# Altium project TIDA-010933-RevA.PrjPcb (part 4 of 8)

## Sheet TIDA-010933-DCDC-Power.SchDoc
size 431 x 279 mm; Date: Not shown in title block; ApprovedBy: Not shown in title block; CheckedBy: Not shown in title block; Author: Not shown in title block; CompanyName: Not shown in title block; Engineer: Not shown in title block; Organization: Not shown in title block; Address1: Not shown in title block; Address2: Not shown in title block; Address3: Not shown in title block; Address4: Not shown in title block; DocumentNumber: 2; Revision: Use project parameter SCH_Rev; SheetNumber: 6; SheetTotal: 11; PageSetup: Record=PageOptions|CenterHorizontal=True|CenterVertical=True|PrintScale=1.00|XCorrection=1.00|YCorrection=1.00|PrintKind=0|BorderSize=5000000|LeftOffset=0|BottomOffset=0|Orientation=2|PaperLength=1000|PaperWidth=1000|Scale=100|PaperSource=15|PrintQuality=600|MediaType=1|DitherType=10|PaperKind=Letter|PrintScaleMode=1; CurrentTime: Not shown in title block; CurrentDate: Not shown in title block; Time: Not shown in title block; DocumentFullPathAndName: Not shown in title block; DocumentName: Not shown in title block; ModifiedDate: 1/25/2022; ImagePath: Not shown in title block
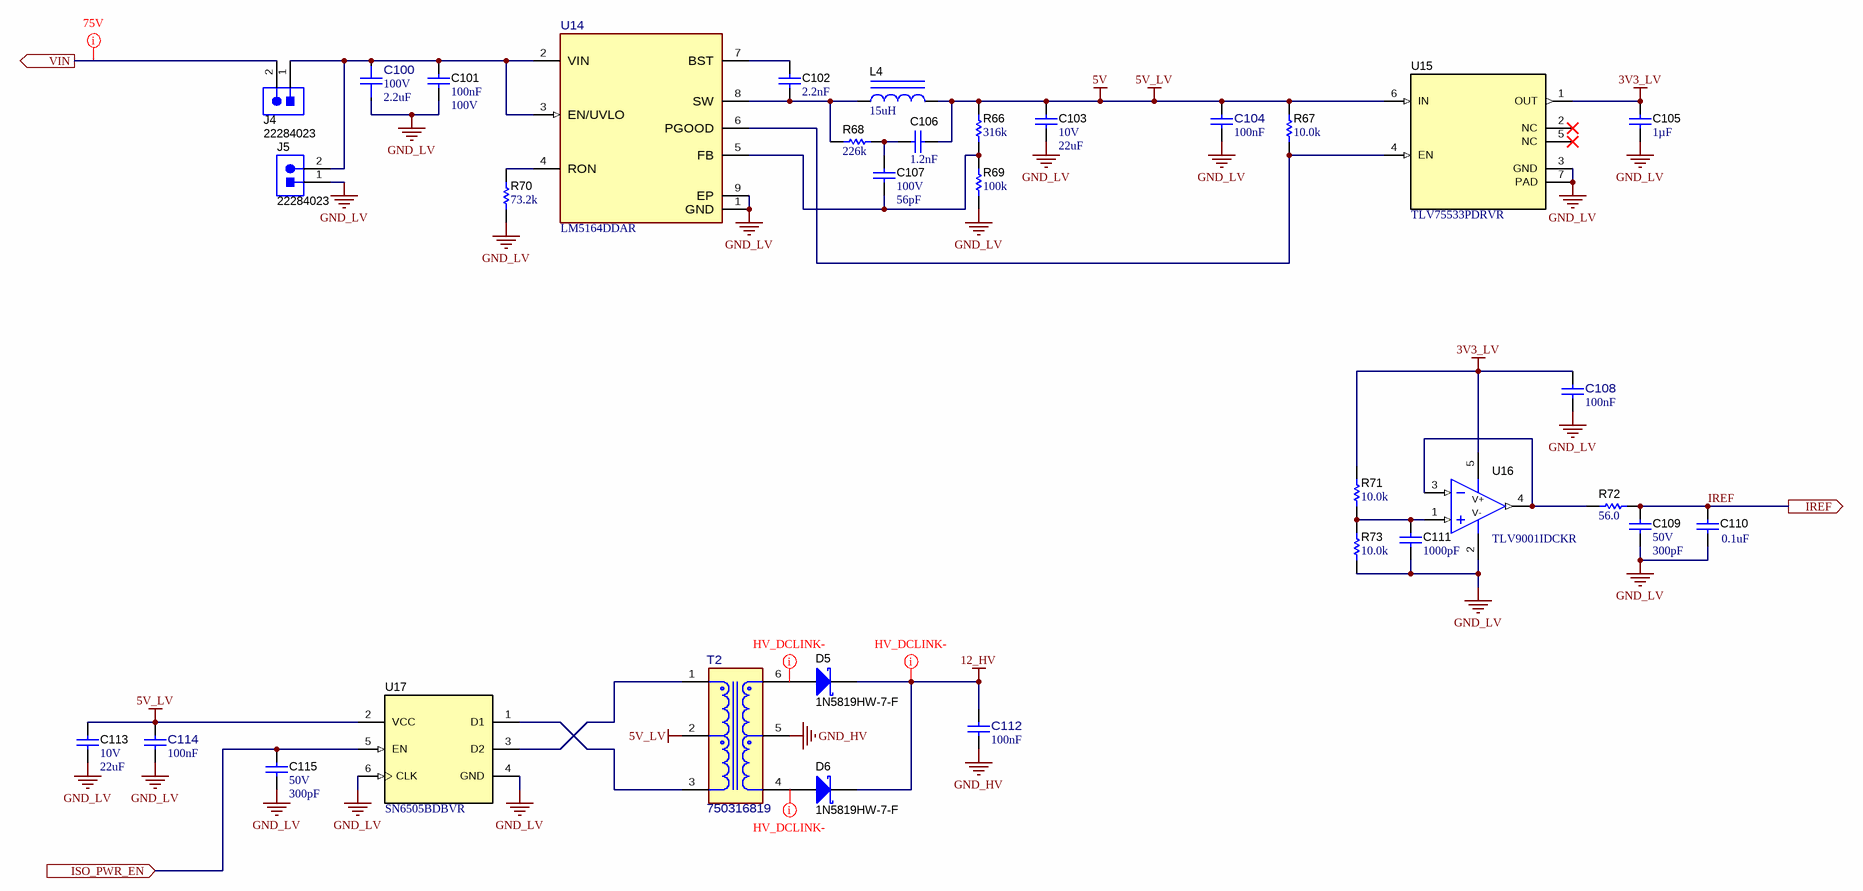
[diagram p5: TIDA-010933-DCDC-Power.SchDoc]

### Parts
C100  VDC_V: 100V  ValueDisplayed: 2.2uF  [FP-C3225X7R2A225K230AB_1210-MFG]  (hidden comment: C3225X7R2A225K230AB)
C101  Cap_F: 100nF  VDC_V: 100V  [0603]  (hidden comment: GRM188R72A104KA35D)
C102  Cap_F: 2.2nF  [0603]  (hidden comment: C0603C222K5RAC)
C103  VDC_V: 10V  ValueDisplayed: 22uF  [1206_180]  (hidden comment: GRM31CR71A226KE15L)
C104  Cap_F: 100nF  [FP-CL10B104KB8NNNC_0603-IPC_B]  (hidden comment: CL10B104KB8NNNC)
C105  Cap_F: 1µF  [0603]  (hidden comment: 885012206026)
C106  Cap_F: 1.2nF  [0603]  (hidden comment: GRM188R72A122KA01D)
C107  VDC_V: 100V  ValueDisplayed: 56pF  [0603]  (hidden comment: GRM1885C2A560JA01D)
C108  Cap_F: 100nF  [FP-CL10B104KB8NNNC_0603-IPC_B]  (hidden comment: CL10B104KB8NNNC)
C109  VDC_V: 50V  ValueDisplayed: 300pF  [0603]  (hidden comment: GRM1885C1H301JA01D)
C110  ValueDisplayed: 0.1uF  [0402]  (hidden comment: GRM155R71E104KE14D)
C111  ValueDisplayed: 1000pF  [0603]  (hidden comment: CC0603JRNPO8BN102)
C112  Cap_F: 100nF  [FP-CL10B104KB8NNNC_0603-IPC_B]  (hidden comment: CL10B104KB8NNNC)
C113  VDC_V: 10V  ValueDisplayed: 22uF  [1206_180]  (hidden comment: GRM31CR71A226KE15L)
C114  Cap_F: 100nF  [FP-CL10B104KB8NNNC_0603-IPC_B]  (hidden comment: CL10B104KB8NNNC)
C115  VDC_V: 50V  ValueDisplayed: 300pF  [0603]  (hidden comment: GRM1885C1H301JA01D)
D5  1N5819HW-7-F  [SOD-123]
D6  1N5819HW-7-F  [SOD-123]
J4  22284023  [Molex_0022284023]
J5  22284023  [Molex_0022284023]
L4  ValueDisplayed: 15uH  [SRP6540]  (hidden comment: SRP6540-150M)
R66  ValueDisplayed: 316k  [0603]  (hidden comment: RC0603FR-07316KL)
R67  ValueDisplayed: 10.0k  [0402]  (hidden comment: RC0402FR-0710KL)
R68  ValueDisplayed: 226k  [0603]  (hidden comment: RC0603FR-07226KL)
R69  ValueDisplayed: 100k  [0603]  (hidden comment: RC0603FR-07100KL)
R70  ValueDisplayed: 73.2k  [0603]  (hidden comment: RC0603FR-0773K2L)
R71  ValueDisplayed: 10.0k  [0603]  (hidden comment: RT0603BRD0710KL)
R72  ValueDisplayed: 56.0  [0603]  (hidden comment: RC0603FR-0756RL)
R73  ValueDisplayed: 10.0k  [0603]  (hidden comment: RT0603BRD0710KL)
T2  750316819  [FP-750316819_SMT_XFRMR_9MM25_8MM30-MFG]
U14  LM5164DDAR  [DDA0008E-MFG]
U15  TLV75533PDRVR  [DRV0006A]
U16  TLV9001IDCKR  [DCK0005A_N]
U17  SN6505BDBVR  [DBV0006A_L]

### Ports
IREF (out), ISO_PWR_EN (in), VIN (out)

### Nets
3V3_LV: C105.1 C108.1 R71.1 U15.1(OUT) U16.5(V+)  [project net 3V3]
5V: C103.1 C104.2 C106.1 C113.1 C114.1 L4.2 R66.2 R67.2 T2.2 U15.6(IN) U17.2(VCC)  [also labelled 5V_LV]
12_HV: C112.1 D5.1(K) D6.1(K)
GND_HV: C112.2 T2.5
GND_LV: C100.1 C101.2 C103.2 C104.1 C105.2 C108.2 C109.2 C110.2 C111.2 C113.2 C114.2 C115.2 J5.1 R69.1 R70.1 R73.2 U14.1(GND) U14.9(EP) U15.3(GND) U15.7(PAD) U16.2(V-) U17.4(GND) U17.6(CLK)  [project net GND]
75V: J4.2 ; port VIN
IREF: C109.1 C110.1 R72.2 ; port IREF
ISO_PWR_EN: C115.1 U17.5(EN) ; port ISO_PWR_EN
NetC100_2: C100.2 C101.1 J4.1 J5.2 U14.2(VIN) U14.3(EN/UVLO)
NetC102_1: C102.1 U14.7(BST)
NetC102_2: C102.2 L4.1 R68.1 U14.8(SW)
NetC106_2: C106.2 C107.1 R68.2
NetC107_2: C107.2 R66.1 R69.2 U14.5(FB)
NetC111_1: C111.1 R71.2 R73.1 U16.1(IN+)
NetD5_2: D5.2(A) T2.6
NetD6_2: D6.2(A) T2.4
NetR67_1: R67.1 U14.6(PGOOD) U15.4(EN)
NetR70_2: R70.2 U14.4(RON)
NetR72_1: R72.1 U16.3(IN-) U16.4(OUT)
NetT2_1: T2.1 U17.3(D2)
NetT2_3: T2.3 U17.1(D1)

Not connected (* = marked no-connect by the designer): U15 2(NC)* 5(NC)*

### Layout directives
net class 75V: 75V
net class HV_DCLINK-: 12_HV, NetD5_2, NetD6_2

### Notes on the sheet
- Drawn By:
- SVN Rev:
- Number:
- TID #:
- Orderable:
- Rev:
- Sheet Title:
- File:
- Project Title:
- Designed for:
- Assembly Variant:
- Mod. Date:
- Sheet:
- Size:
- of
- B
- http://www.ti.com
- Texas Instruments and/or its licensors do not warrant the accuracy or completeness of this specification or any information contained therein. Texas Instruments and/or its licensors do not warrant that this design will meet the specifications, will be suitable for your application or fit for any particular purpose, or will operate in an implementation. Texas Instruments and/or its licensors do not warrant that the design is production worthy. You should completely validate and test your design implementation to confirm the system functionality for your application.
- Engineer:
- Contact:
- © Texas Instruments

### Library data of the parts
C100 = CMP-0095533-2: CAP, CERM, 2.2 uF, 100 V, +/- 10%, X7R, 1210; Manufacturer: TDK; AEC Qualified: No; Value: 2.2µF; Tolerance_%: 0.1%; TempCo: 0.15; SizeZ_mm: 2.5mm; RoHS: TRUE; ComponentLink1URL: https://product.tdk.com/en/search/capacitor/ceramic/mlcc/info?part_no=C3225X7R2A225K230AB; Part Number: C3225X7R2A225K230AB; ComponentLink1Description: Datasheet; PartNumber: C3225X7R2A225K230AB; Datasheet Path: datasheets/Cap-C3225X7R2A225K230AB.pdf; Operating Temperature Range: -55°C  to +125°C; PackageReference: 1210; Lead Free: Yes; datasheet: https://product.tdk.com/en/search/capacitor/ceramic/mlcc/info?part_no=C3225X7R2A225K230AB; Temperature Characteristic: X7R; Cap_F: 2.2µF; helpURL: https://upverter.com/upn/revision/88efa44f12133509/
C101 = CMP-0007469-4: CAP, CERM, 0.1 uF, 100 V, +/- 10%, X7R, 0603; Manufacturer: MuRata; TaMin_C: -55°C; Polarized: N; SizeAreaWB_mm2: 4.68; Value1: Unknown; U/M: EA; Value: 0.1uF; TaMax_C: 125°C; SizeZ_mm: 1; SizeX_mm: 1.6; SizeY_mm: 0.8; SizeArea_mm2: 1.28; AEC Category: Q200; Supplier Part Number 2: 81-GRM188R72A104KA35; Publisher: Texas Instruments; Supplier 2: Mouser; Supplier Part Number 3: 1828921; TempCo: X7R; Supplier 3: Farnell; Published: 2008-06-19; RoHS: Y; MountType: SMT; Supplier 1: Digi-Key; PackageReference: 0603; Tolerance_%: 10%; Cap_Case: 0603; Value2: 100V; CompType: Capacitor; LatestRevisionDate: 2017-03-09; PartNumber: GRM188R72A104KA35D; AEC Qualified: ?; ComponentLink1Description: Datasheet link; Supplier Part Number 1: 490-3285-1-ND; Technology: Ceramic; ValueDisplayed: 0.1uF; ComponentLink1URL: http://search.murata.co.jp/Ceramy/PnsearchViewAction.do?HnOFG=ON&HnNFG=ON&SEL_CNT=50&sLang=en&sKey=GRM188R72A104KA35D&x=9&y=9&search=startwith
C102 = CMP-0006897-4: CAP, CERM, 2200 pF, 50 V, +/- 10%, X7R, 0603; Manufacturer: Kemet; TaMin_C: -55°C; Polarized: N; SizeAreaWB_mm2: 4.68; Value1: Unknown; U/M: EA; Value: 2200pF; TaMax_C: 125°C; SizeZ_mm: 1; SizeX_mm: 1.6; SizeY_mm: 0.8; Value2: 50V; SizeArea_mm2: 1.28; AEC Category: Q200; Publisher: Texas Instruments; TempCo: X7R; Published: 2008-06-19; RoHS: Y; MountType: SMT; Supplier 1: Farnell; PackageReference: 0603; Tolerance_%: 10%; Cap_Case: 0603; CompType: Capacitor; LatestRevisionDate: 2017-03-09; PartNumber: C0603C222K5RAC; AEC Qualified: ?; VDC_V: 50V; ComponentLink1Description: Datasheet link; Supplier Part Number 1: 1362428; Technology: Ceramic; ValueDisplayed: 2200pF; ComponentLink1URL: http://www.kemet.com/kemet/web/homepage/kechome.nsf/vapubfiles/F3102_Y5V.pdf/$file/F3102_Y5V.pdf
C103 C113 = CMP-0008959-2: CAP, CERM, 22 uF, 10 V, +/- 10%, X7R, 1206; Manufacturer: MuRata; TaMin_C: -55°C; Polarized: N; SizeAreaWB_mm2: 10.92; Value1: Unknown; U/M: EA; Value: 22uF; TaMax_C: 125°C; SizeZ_mm: 1.8; SizeX_mm: 3.2; SizeY_mm: 1.6; Cap_Case: 1206; SizeArea_mm2: 5.12; Cap_F: 22µF; AEC Category: Q200; Supplier Part Number 2: 81-GRM31CR71A226K15L; Publisher: Texas Instruments; Supplier 2: Mouser; Supplier Part Number 3: 1797016; TempCo: X7R; Supplier 3: Farnell; Published: 2008-06-19; RoHS: Y; MountType: SMT; Supplier 1: Digi-Key; PackageReference: 1206; Tolerance_%: 10%; Value2: 10V; CompType: Capacitor; LatestRevisionDate: 2017-03-09; PartNumber: GRM31CR71A226KE15L; AEC Qualified: ?; ComponentLink1Description: Datasheet link; Supplier Part Number 1: 490-5309-1-ND; Technology: Ceramic; ComponentLink1URL: http://search.murata.co.jp/Ceramy/PnsearchViewAction.do?HnOFG=ON&HnNFG=ON&SEL_CNT=50&sLang=en&sKey=GRM31CR71A226KE15L&x=9&y=9&search=startwith
C104 C108 C112 C114 = CMP-0087079-2: as C82 on sheet TIDA-010933-DCDC-HVGAN; ComponentLink1Description: Datasheet; PackageReference: 0603; RoHS: TRUE; ComponentLink1URL: http://www.samsungsem.com/kr/support/product-search/mlcc/__icsFiles/afieldfile/2018/07/24/CL10B104KB8NNNC.pdf; VDC_V: 50V; PartNumber: CL10B104KB8NNNC
C105 = CMP-0064932-4: CAP, CERM, 1 uF, 10 V,+/- 10%, X7R, 0603; Manufacturer: Wurth Elektronik; TaMin_C: -55°C; Polarized: N; SizeAreaWB_mm2: 4.68; Value1: Unknown; U/M: EA; Value: 1uF; TaMax_C: 125°C; SizeZ_mm: 1; SizeX_mm: 1.6; SizeY_mm: 0.8; Value2: 10V; SizeArea_mm2: 1.28; AEC Category: Q200; Supplier Part Number 2: 15AC9362; Publisher: Texas Instruments; Supplier 2: Newark; Supplier Part Number 3: 710-885012206026; TempCo: X7R; Supplier 3: Mouser; Published: 2008-06-19; RoHS: Y; MountType: SMT; Supplier 1: Digi-Key; PackageReference: 0603; Tolerance_%: 10%; Cap_Case: 0603; CompType: Capacitor; LatestRevisionDate: 2017-06-05; PartNumber: 885012206026; AEC Qualified: N; VDC_V: 10V; ComponentLink1Description: Datasheet link; AEC Grade: N/A; Supplier Part Number 1: 732-7945-1-ND; Technology: Ceramic; ValueDisplayed: 1uF; ComponentLink1URL: http://katalog.we-online.com/pbs/datasheet/885012206026.pdf
C106 = CMP-0007471-5: CAP, CERM, 1200 pF, 100 V, +/- 10%, X7R, 0603; Manufacturer: MuRata; TaMin_C: -55°C; Polarized: N; SizeAreaWB_mm2: 4.68; Value1: Unknown; U/M: EA; Value: 1200pF; TaMax_C: 125°C; SizeZ_mm: 1; SizeX_mm: 1.6; SizeY_mm: 0.8; Value2: 100V; SizeArea_mm2: 1.28; AEC Category: Q200; Supplier Part Number 2: 81-GRM18R72A122KA01D; Publisher: Texas Instruments; Supplier 2: Mouser; TempCo: X7R; Published: 2008-06-19; RoHS: Y; MountType: SMT; Supplier 1: Digi-Key; PackageReference: 0603; Tolerance_%: 10%; Cap_Case: 0603; CompType: Capacitor; LatestRevisionDate: 2017-03-09; PartNumber: GRM188R72A122KA01D; AEC Qualified: ?; VDC_V: 100V; ComponentLink1Description: Datasheet link; Supplier Part Number 1: 490-1474-1-ND; Technology: Ceramic; ValueDisplayed: 1200pF; ComponentLink1URL: http://search.murata.co.jp/Ceramy/PnsearchViewAction.do?HnOFG=ON&HnNFG=ON&SEL_CNT=50&sLang=en&sKey=GRM188R72A122KA01D&x=9&y=9&search=startwith
C107 = CMP-0007275-4: CAP, CERM, 56 pF, 100 V, +/- 5%, C0G/NP0, 0603; Manufacturer: MuRata; TaMin_C: -55°C; Polarized: N; SizeAreaWB_mm2: 4.68; Value1: Unknown; U/M: EA; Value: 56pF; TaMax_C: 125°C; SizeZ_mm: 1; SizeX_mm: 1.6; SizeY_mm: 0.8; SizeArea_mm2: 1.28; AEC Category: Q200; Supplier Part Number 2: 81-GRM185C2A560JA01D; Publisher: Texas Instruments; Supplier 2: Mouser; TempCo: C0G/NP0; Published: 2008-06-19; RoHS: Y; MountType: SMT; Supplier 1: Digi-Key; PackageReference: 0603; Tolerance_%: 5%; Cap_Case: 0603; Value2: 100V; CompType: Capacitor; LatestRevisionDate: 2017-03-09; PartNumber: GRM1885C2A560JA01D; Cap_F: 56pF; ComponentLink1Description: Datasheet link; Supplier Part Number 1: 490-1345-1-ND; Technology: Ceramic; AEC Qualified: ?; ComponentLink1URL: http://search.murata.co.jp/Ceramy/PnsearchViewAction.do?HnOFG=ON&HnNFG=ON&SEL_CNT=50&sLang=en&sKey=GRM1885C2A560JA01D&x=9&y=9&search=startwith
C109 C115 = CMP-0007206-4: CAP, CERM, 300 pF, 50 V, +/- 5%, C0G/NP0, 0603; Manufacturer: MuRata; TaMin_C: -55°C; Polarized: N; SizeAreaWB_mm2: 4.68; Value1: Unknown; U/M: EA; Value: 300pF; TaMax_C: 125°C; SizeZ_mm: 1; SizeX_mm: 1.6; SizeY_mm: 0.8; SizeArea_mm2: 1.28; AEC Category: Q200; Supplier Part Number 2: 81-GRM185C1H301JA01D; Publisher: Texas Instruments; Supplier 2: Mouser; TempCo: C0G/NP0; Published: 2008-06-19; RoHS: Y; MountType: SMT; Supplier 1: Digi-Key; PackageReference: 0603; Tolerance_%: 5%; Cap_Case: 0603; Value2: 50V; CompType: Capacitor; LatestRevisionDate: 2017-03-09; PartNumber: GRM1885C1H301JA01D; AEC Qualified: ?; Cap_F: 300pF; ComponentLink1Description: Datasheet link; Supplier Part Number 1: 490-1438-1-ND; Technology: Ceramic; ComponentLink1URL: http://search.murata.co.jp/Ceramy/PnsearchViewAction.do?HnOFG=ON&HnNFG=ON&SEL_CNT=50&sLang=en&sKey=GRM1885C1H301JA01D&x=9&y=9&search=startwith
C110 = CMP-0006659-2: CAP, CERM, 0.1 uF, 25 V, +/- 10%, X7R, 0402; Manufacturer: MuRata; TaMin_C: -55°C; Polarized: N; SizeAreaWB_mm2: 3; Value1: Unknown; U/M: EA; Value: 0.1uF; TaMax_C: 125°C; SizeZ_mm: 0.6; SizeX_mm: 1; SizeY_mm: 0.5; Value2: 25V; Cap_F: 100nF; AEC Category: Q200; Supplier Part Number 2: 31Y1751; Publisher: Texas Instruments; Supplier 2: Newark; Supplier Part Number 3: 81-GRM155R71E104KE4D; TempCo: X7R; Supplier 3: Mouser; Published: 2008-06-19; RoHS: Y; MountType: SMT; Supplier 1: Digi-Key; PackageReference: 0402; Tolerance_%: 10%; Cap_Case: 0402; SizeArea_mm2: 0.5; CompType: Capacitor; LatestRevisionDate: 2017-03-09; PartNumber: GRM155R71E104KE14D; AEC Qualified: N; VDC_V: 25V; ComponentLink1Description: Datasheet link; AEC Grade: N/A; Supplier Part Number 1: 490-10698-1-ND; Technology: Ceramic; ComponentLink1URL: http://search.murata.co.jp/Ceramy/image/img/A01X/G101/ENG/GRM155R71E104KE14-01.pdf
C111 = CMP-0860530-1: CAP, CERM, 1000 pF, 25 V,+/- 5%, C0G/NP0, 0603; Manufacturer: Yageo; SizeX_mm: 1.6; SizeArea_mm2: 1.28; Value: 1000pF; AEC Category: Q200; Cap_F: 1nF; Value2: 25V; Polarized: N; U/M: EA; SizeY_mm: 0.8; SizeZ_mm: 1; TaMax_C: 125°C; TaMin_C: -55°C; SizeAreaWB_mm2: 4.68; AEC Grade: N/A; MountType: SMT; ComponentLink1URL: http://www.yageo.com/documents/recent/UPY-GP_NP0_16V-to-50V_16.pdf; ComponentLink1Description: Datasheet link; PartNumber: CC0603JRNPO8BN102; Cap_Case: 0603; AEC Qualified: N; Technology: Ceramic; CompType: Capacitor; RoHS: Y; PackageReference: 0603; VDC_V: 25V; Tolerance_%: 5%; TempCo: C0G/NP0
D5 D6 = CMP-0028360-2: Diode, Schottky, 40 V, 1 A, SOD-123; Manufacturer: Diodes Inc.; Green_Lifecycle: Active; AEC Category: Q101; TJmax_C: 125°C; SizeArea_mm2: 6.545; Vr_V: 40V; Value1: 1A; SizeZ_mm: 1.35; Value: 40V; Vf_V: 450mV; SizeX_mm: 3.85; Green_REACh: Passed; Value2: 0.45V; SizeY_mm: 1.7; SizeAreaWB_mm2: 13.095; Green_EU RoHS: Passed; AEC Qualified: ?; ComponentLink1Description: Datasheet link; Type: Schottky; RoHS: Y; MountType: SMT; PackageReference: SOD-123; CompType: Diode; Io_A: 1A; PartNumber: 1N5819HW-7-F; ComponentLink1URL: http://www.diodes.com/datasheets/ds30217.pdf; Green_EU RoHS-2: Passed
J4 J5 = CMP-0055333-1: Header, 2.54mm, 2x1, Tin, TH; Manufacturer: Molex; CNHeader: TRUE; Current_A: 4A; Shrouded: N; Gender: Male; Voltage_V: 250V; Row_Count: 1; Pitch_mm: 2.54; CT: FALSE; Cert_UL: Y; ComponentLink1URL: http://www.molex.com/pdm_docs/sd/022284023_sd.pdf; ClassName: Header; Publisher: Texas Instruments; Color: Black; RoHS: Y; MountType: TH; Supplier 1: Digi-Key; PackageReference: Header, 2.54mm, 2x1, TH; PinCount: 2; CompType: Header; LatestRevisionDate: 26/05/2017; PartNumber: 22284023; Orientation: Vertical; ComponentLink1Description: Datasheet URL; Supplier Part Number 1: WM50016-02-ND; ContactFinish: Tin
L4 = CMP-0057696-2: Inductor, Shielded, Ferrite, 15 uH, 2.9 A, 0.121 ohm, SMD; Manufacturer: Bourns; Isat: 2.9A @ 20% inductance drop; Irms: 2.9A @ 40C rise; Green_Lifecycle: Active; SizeAreaWB_mm2: 82.65; DCR_ohm: 0.121; Green_REACh: Passed; Value: 15uH; Imax_A: 2.9A; SizeZ_mm: 4; SizeX_mm: 7.5; SizeY_mm: 6.7; SizeArea_mm2: 50.25; Ind_H: 15µH; AEC Category: Q200; Publisher: Texas Instruments; Published: 2008-06-26; RoHS: Y; Value1: 0.121 ohm; Material: Ferrite; MountType: SMT; Green_EU RoHS-2: Incomplete; Supplier 1: Mouser; Green_EU RoHS: Passed; PackageReference: Inductor, 7.2x4x6.5mm; Value2: 2.9A; CompType: Inductor; LatestRevisionDate: 2017-06-02; PartNumber: SRP6540-150M; AEC Qualified: ?; ComponentLink1Description: Datasheet link; Supplier Part Number 1: 652-SRP6540-150M; Technology: Shielded; ComponentLink1URL: http://www.bourns.com/data/global/pdfs/SRP6540.pdf
R66 = CMP-0023024-4: RES, 316 k, 1%, 0.1 W, 0603; Manufacturer: Yageo; Power_W: 100mW; TempCo: 100 ppm/C; Value: 316k; EIA_Code: E96; SizeX_mm: 1.6; SizeY_mm: 0.8; SizeZ_mm: 1; Value2: 0.1W; SizeArea_mm2: 1.28; AEC Qualified: N; VDC_V: 75V; AEC Category: Q200; SizeAreaWB_mm2: 4.68; ComponentLink1URL: http://www.yageo.com/pdf/Pu-RC0603_51_PbFree_L_2.pdf; Supplier Part Number 2: 603-RC0603FR-07316KL; Supplier 2: Mouser; Value_Code: 316k; RoHS: Y; Value1: 1%; MountType: SMT; Supplier 1: Digi-Key; PackageReference: 0603; Tolerance_%: 1%; Res_ohm: 316k; CompType: Resistor; PartNumber: RC0603FR-07316KL; ComponentLink1Description: Datasheet link; Supplier Part Number 1: 311-316KHRCT-ND; Technology: Thick Film; AEC Grade: N/A
R67 = CMP-0078669-1: RES, 10.0 k, 1%, 0.063 W, 0402; Manufacturer: Yageo America; Power_W: 63mW; Green_Lifecycle: Active; TempCo: 100 ppm/C; Value_Code: 10k0; Green_REACh: Passed; Value: 10.0k; EIA_Code: E96; Res_ohm: 10k; SizeX_mm: 1; SizeY_mm: 0.5; SizeZ_mm: 0.6; Value2: 0.063W; AEC Qualified: N; AEC Category: Q200; ComponentLink1URL: http://www.yageo.com/documents/recent/PYu-RC_Group_51_RoHS_L_8.pdf; Supplier Part Number 2: 98K7499; Supplier 2: Newark; Supplier Part Number 3: 603-RC0402FR-0710KL; Supplier 3: Mouser; RoHS: Y; Value1: 1%; MountType: SMT; Green_EU RoHS-2: Passed; Supplier 1: Digi-Key; Green_EU RoHS: Passed with Exemption; PackageReference: 0402; Tolerance_%: 1%; SizeArea_mm2: 0.5; CompType: Resistor; PartNumber: RC0402FR-0710KL; ComponentLink1Description: Datasheet link; AEC Grade: N/A; Supplier Part Number 1: 311-10.0KLRCT-ND; Technology: Thick Film
R68 = CMP-0022921-4: RES, 226 k, 1%, 0.1 W, 0603; Manufacturer: Yageo; Power_W: 100mW; TempCo: 100 ppm/C; Value: 226k; EIA_Code: E96; SizeX_mm: 1.6; SizeY_mm: 0.8; SizeZ_mm: 1; Value2: 0.1W; SizeArea_mm2: 1.28; AEC Qualified: N; VDC_V: 75V; AEC Category: Q200; SizeAreaWB_mm2: 4.68; ComponentLink1URL: http://www.yageo.com/pdf/Pu-RC0603_51_PbFree_L_2.pdf; Supplier Part Number 2: 603-RC0603FR-07226KL; Supplier 2: Mouser; Supplier Part Number 3: 9238646; Supplier 3: Farnell; Value_Code: 226k; RoHS: Y; Value1: 1%; MountType: SMT; Supplier 1: Digi-Key; PackageReference: 0603; Tolerance_%: 1%; Res_ohm: 226k; CompType: Resistor; PartNumber: RC0603FR-07226KL; ComponentLink1Description: Datasheet link; Supplier Part Number 1: 311-226KHRCT-ND; Technology: Thick Film; AEC Grade: N/A
R69 = CMP-0022735-5: RES, 100 k, 1%, 0.1 W, 0603; Manufacturer: Yageo; Power_W: 100mW; TempCo: 100 ppm/C; Value: 100k; EIA_Code: E96; SizeX_mm: 1.6; SizeY_mm: 0.8; SizeZ_mm: 1; Value2: 0.1W; SizeArea_mm2: 1.28; AEC Qualified: N; VDC_V: 75V; AEC Category: Q200; SizeAreaWB_mm2: 4.68; Supplier Part Number 2: 603-RC0603FR-07100KL; Supplier 2: Mouser; Supplier Part Number 3: 9238727; Supplier 3: Farnell; Value_Code: 100k; RoHS: Y; Value1: 1%; MountType: SMT; Supplier 1: Digi-Key; PackageReference: 0603; Tolerance_%: 1%; Res_ohm: 100k; CompType: Resistor; PartNumber: RC0603FR-07100KL; ComponentLink1Description: Datasheet link; Supplier Part Number 1: 311-100KHRCT-ND; Technology: Thick Film; ComponentLink1URL: http://www.yageo.com/pdf/Pu-RC0603_51_PbFree_L_2.pdf; AEC Grade: N/A
R70 = CMP-0023263-5: RES, 73.2 k, 1%, 0.1 W, 0603; Manufacturer: Yageo; Power_W: 100mW; TempCo: 100 ppm/C; Value_Code: 73k2; Value: 73.2k; EIA_Code: E96; SizeX_mm: 1.6; SizeY_mm: 0.8; SizeZ_mm: 1; Value2: 0.1W; SizeArea_mm2: 1.28; AEC Qualified: N; VDC_V: 75V; AEC Category: Q200; SizeAreaWB_mm2: 4.68; Supplier Part Number 2: 603-RC0603FR-0773K2L; Supplier 2: Mouser; RoHS: Y; Value1: 1%; MountType: SMT; Supplier 1: Digi-Key; PackageReference: 0603; Tolerance_%: 1%; Res_ohm: 73.2k; CompType: Resistor; PartNumber: RC0603FR-0773K2L; ComponentLink1Description: Datasheet link; Supplier Part Number 1: 311-73.2KHRCT-ND; Technology: Thick Film; ComponentLink1URL: http://www.yageo.com/pdf/Pu-RC0603_51_PbFree_L_2.pdf; AEC Grade: N/A
R71 R73 = CMP-0023653-3: RES, 10.0 k, 0.1%, 0.1 W, 0603; Manufacturer: Yageo America; Power_W: 100mW; TempCo: 25 ppm/C; Value_Code: 10k0; U/M: EA; Value: 10.0k; EIA_Code: E192; Res_ohm: 10k; SizeX_mm: 1.6; SizeY_mm: 0.8; SizeZ_mm: 1; Value2: 0.1W; SizeArea_mm2: 1.28; VDC_V: 75V; AEC Category: Q200; Publisher: Texas Instruments; Published: 2008-06-26; RoHS: Y; Value1: 0.1%; MountType: SMT; PackageReference: 0603; Tolerance_%: 0.1%; CompType: Resistor; LatestRevisionDate: 2017-03-09; PartNumber: RT0603BRD0710KL; AEC Qualified: ?; ComponentLink1Description: Datasheet link; Technology: Thin Film; ComponentLink1URL: http://www.yageo.com/pdf/PYu-RT_1-to-0.05_RoHS_L_3.pdf
R72 = CMP-0023188-5: as R57-R59 on sheet TIDA-010933-DCDC-HVGAN; Supplier Part Number 2: 603-RC0603FR-0756RL; Supplier 2: Mouser; Supplier Part Number 3: 9238336; Supplier 3: Farnell; RoHS: Y; Value1: 1%; MountType: SMT; Supplier 1: Digi-Key; PackageReference: 0603; Tolerance_%: 1%; CompType: Resistor; PartNumber: RC0603FR-0756RL; ComponentLink1Description: Datasheet link; Supplier Part Number 1: 311-56.0HRCT-ND; Technology: Thick Film; ComponentLink1URL: http://www.yageo.com/pdf/Pu-RC0603_51_PbFree_L_2.pdf; AEC Grade: N/A
T2 = CMP-0092459-1: Forward, Push-Pull Converters For For DC/DC Converters SMPS Transformer 2500Vrms Isolation 400kHz Surface Mount; Manufacturer: Wurth Electronics; AEC Qualified: No; SizeZ_mm: 4.1mm; Voltage_Isolation_Vrms: 2.5kV; Ind_H: 86µH; Ns1toNp: 1:2.88; DCR_ohm: 0.1; Rsec1_ohm: 0.35; ComponentLink1URL: https://www.we-online.com/catalog/datasheet/750316819.pdf; ComponentLink1Description: Datasheet; Datasheet Path: datasheets/Trans-750316819.pdf; Mouser Part Number: 710-750316819; Supplier Part Number 2: 710-750316819; Frequency_Fixed: 400kHz; Lead Free: Yes; Digikey Part Number: 732-750316819CT-ND; Supplier 1: Digikey; datasheet: https://www.we-online.com/catalog/datasheet/750316819.pdf; Supplier 2: Mouser; RoHS: TRUE; Part Number: 750316819; Operating Temperature Range: -40°C to +125°C; Supplier Part Number 1: 732-750316819CT-ND; Digikey Description: PUSH-PULL TRANSFORMER TOR5.8/3.1; PackageReference: SMT_XFRMR_9MM25_8MM30; helpURL: https://upverter.com/upn/revision/523575a3b899e5cb/; PartNumber: 750316819
U14 = CMP-0089262-2: Manufacturer: Texas Instruments; AEC Qualified: No; Standoff Height: 0mm; AEC Category: Q200; Max Duty Cycle: 99%; Nominal Supply Current: 600uA; Max Supply Voltage: 100V; Number Of Outputs: 1; Switching Frequency: 1MHz; Output Type: AdjustableProgrammable; Switching Topology: Buck; Min Supply Voltage: 6V; CompType: IC; Output Voltage: 1.2-90V; TJmax_C: +150°C; RoHS: TRUE; Lead Free: Yes; Mouser Description: 6-V to 100-V input, 1-A synchronous buck DC-DC converter with ultra-low IQ 8-SO PowerPAD -40 to 150; ComponentLink2Description: Product Folder; PartNumber: LM5164DDAR; helpURL: https://upverter.com/upn/revision/f50a14a06c929ee3/; Digikey Description: POWER MANAGEMENT; ComponentLink3URL: http://www.ti.com/product/GPN/datasheet; Mouser Part Number: 595-LM5164DDAR; Device Class L1: Integrated Circuits (ICs); Device Class L3: Voltage Regulators - Switching; Device Class L2: Power Management ICs; ComponentLink2URL: http://www.ti.com/product/GPN; ComponentLink3Description: Online Datasheet; Part Number: LM5164DDAR; PackageReference: SOPowerPAD8; ComponentLink1Description: Datasheet; Datasheet Path: datasheets/IC-LM5164DDAR.pdf; datasheet: http://www.ti.com/lit/ds/symlink/lm5164.pdf; Digikey Part Number: 296-LM5164DDARCT-ND; ComponentLink1URL: http://www.ti.com/lit/ds/symlink/lm5164.pdf; Operating Temperature Range: -40°C to +150°C
U15 = CMP-0013427-7: 500mA LDO, DRV0006A (WSON-6); Manufacturer: Texas Instruments; SizeX_mm: 2; CompType: IC; SizeZ_mm: 0.8; SizeArea_mm2: 4; SizeAreaWB_mm2: 9; U/M: EA; PackageDescription: WSON-6; PartNumber: TLV75533PDRVR; ComponentLink1URL: https://sps16.itg.ti.com/sites/KMS/crossdivteams/altium/docs/ComponentDatasheets/SBVS320_TLV755_8_3.pdf; ComponentLink1Description: Datasheet Link; LatestRevisionDate: 2017-03-09; SizeY_mm: 2; Publisher: Texas Instruments; PackageReference: DRV0006A; MountType: SMT; Alternate Manufacturer: Texas Instruments
U16 = CMP-0081556-1: Low-Power, Rail-to-Rail In and Out, 1-MHz Operational Amplifier, DCK0005A (SOT-SC70-5); Alternate PartNumber: TLV9001IDCKT; Alternate Manufacturer: Texas Instruments; SizeAreaWB_mm2: 9.3; SizeZ_mm: 1.1; SizeX_mm: 2.1; SizeY_mm: 2; SizeArea_mm2: 4.2; CompType: IC; AEC Qualified: N; AEC Category: Q200; ComponentLink1URL: http://www.ti.com/lit/ds/symlink/tlv9001.pdf; PackageDescription: SOT-SC70-5; MountType: SMT; ComponentLink2URL: http://www.ti.com/product/tlv9001; ComponentLink3Description: Online Datasheet; ComponentLink2Description: Product Folder; Manufacturer: Texas Instruments; ComponentLink3URL: http://www.ti.com/product/tlv9001/datasheet; PackageReference: DCK0005A; PartNumber: TLV9001IDCKR; ComponentLink1Description: Datasheet Link
U17 = CMP-0076095-1: Low-Noise 1 A, 420 kHz Transformer Driver, DBV0006A (SOT-23-6); Manufacturer: Texas Instruments; Alternate PartNumber: SN6505BDBVT; SizeAreaWB_mm2: 14.82; SizeArea_mm2: 8.12; SizeZ_mm: 1.45; Green_REACh: Passed; SizeY_mm: 2.9; Green_Lifecycle: Active; U/M: EA; CompType: IC; SizeX_mm: 2.8; ComponentLink1Description: Datasheet Link; Green_EU RoHS: Passed; PackageReference: DBV0006A; PartNumber: SN6505BDBVR; Publisher: Texas Instruments; PackageDescription: SOT-23-6; Alternate Manufacturer: Texas Instruments; LatestRevisionDate: 2017-06-09; ComponentLink1URL: http://www.ti.com/lit/ds/symlink/sn6505b.pdf; MountType: SMT; Green_EU RoHS-2: Passed

## Sheet TIDA-010933-DCDC-ControlCard.SchDoc
size 431 x 279 mm; Date: Not shown in title block; ApprovedBy: Not shown in title block; CheckedBy: Not shown in title block; Author: Not shown in title block; CompanyName: Not shown in title block; Engineer: Not shown in title block; Organization: Not shown in title block; Address1: Not shown in title block; Address2: Not shown in title block; Address3: Not shown in title block; Address4: Not shown in title block; DocumentNumber: 2; Revision: Use project parameter SCH_Rev; SheetNumber: 7; SheetTotal: 11; PageSetup: Record=PageOptions|CenterHorizontal=True|CenterVertical=True|PrintScale=1.00|XCorrection=1.00|YCorrection=1.00|PrintKind=0|BorderSize=5000000|LeftOffset=0|BottomOffset=0|Orientation=2|PaperLength=1000|PaperWidth=1000|Scale=100|PaperSource=15|PrintQuality=600|MediaType=1|DitherType=10|PaperKind=Letter|PrintScaleMode=1; CurrentTime: Not shown in title block; CurrentDate: Not shown in title block; Time: Not shown in title block; DocumentFullPathAndName: Not shown in title block; DocumentName: Not shown in title block; ModifiedDate: 1/25/2022; ImagePath: Not shown in title block
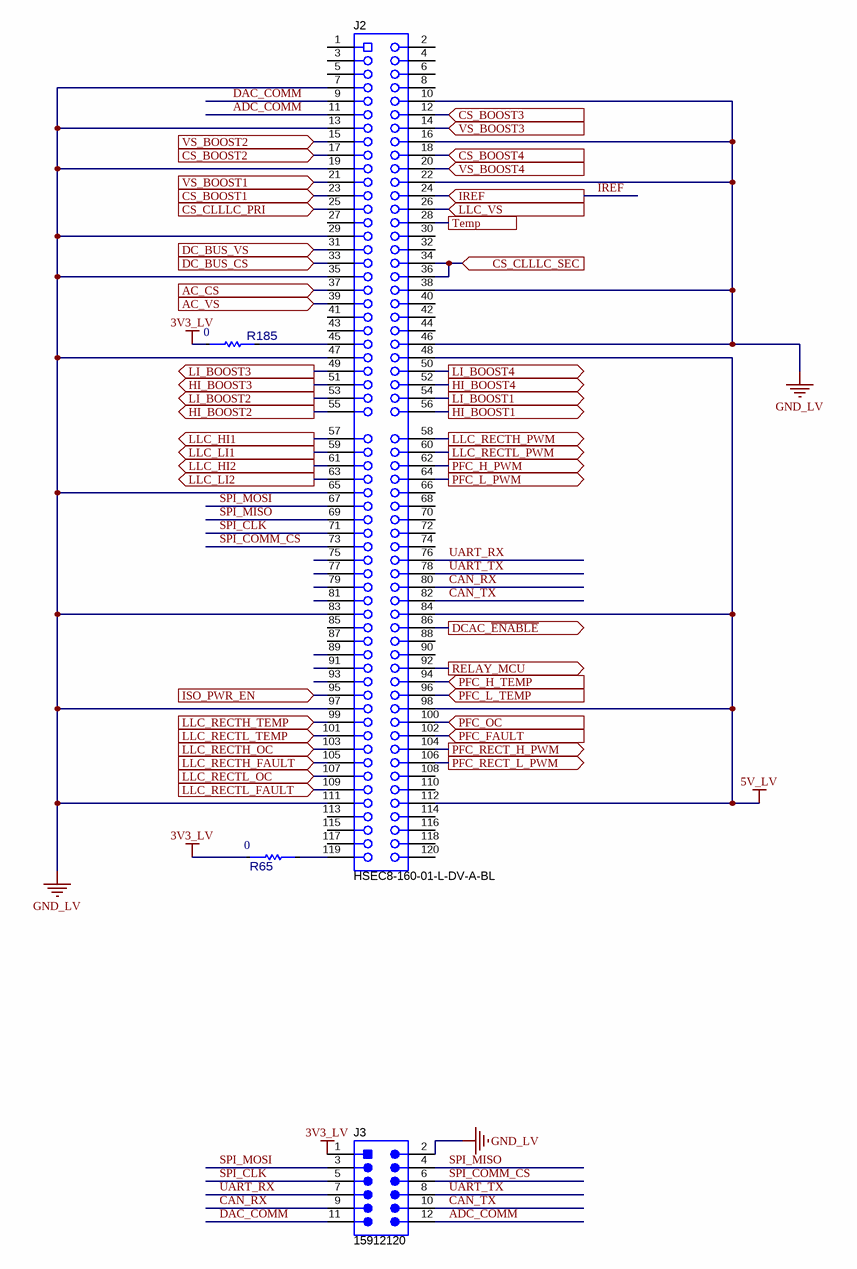
[diagram p6: TIDA-010933-DCDC-ControlCard.SchDoc]

### Parts
J2  HSEC8-160-01-L-DV-A-BL  [controlCARD-120HSEC]
J3  15912120  [MOLEX_0015912120]
R65  value 0  [FP-RC0402JR-070RP_0402-MFG]  (hidden comment: RC0402JR-070RP)
R185  value 0  [FP-RC0402JR-070RP_0402-MFG]  (hidden comment: RC0402JR-070RP)

### Ports
AC_CS (in), AC_VS (in), CS_BOOST1 (in), CS_BOOST2 (in), CS_BOOST3 (in), CS_BOOST4 (in), CS_CLLLC_PRI (in), CS_CLLLC_SEC (in), DC_BUS_CS (in), DC_BUS_VS (in), DCAC_~{ENABLE} (out), HI_BOOST1 (out), HI_BOOST2 (out), HI_BOOST3 (out), HI_BOOST4 (out), IREF (in), ISO_PWR_EN (in), LI_BOOST1 (out), LI_BOOST2 (out), LI_BOOST3 (out), LI_BOOST4 (out), LLC_HI1 (out), LLC_HI2 (out), LLC_LI1 (out), LLC_LI2 (out), LLC_RECTH_FAULT (in), LLC_RECTH_OC (in), LLC_RECTH_PWM (out), LLC_RECTH_TEMP (in), LLC_RECTL_FAULT (in), LLC_RECTL_OC (in), LLC_RECTL_PWM (out), LLC_RECTL_TEMP (in), LLC_VS (in), PFC_FAULT (in), PFC_H_PWM (out), PFC_H_TEMP (in), PFC_L_PWM (out), PFC_L_TEMP (in), PFC_OC (in), PFC_RECT_H_PWM (out), PFC_RECT_L_PWM (out), RELAY_MCU (out), Temp, VS_BOOST1 (in), VS_BOOST2 (in), VS_BOOST3 (in), VS_BOOST4 (in)

### Nets
3V3_LV: J3.1 R65.1 R185.1  [project net 3V3]
5V_LV: J2.48 J2.84 J2.98 J2.112  [project net 5V]
GND_LV: J2.7 J2.10 J2.13 J2.16 J2.19 J2.22 J2.29 J2.35 J2.38 J2.46 J2.47 J2.65 J2.83 J2.97 J2.111 J3.2  [project net GND]
AC_CS: J2.37 ; port AC_CS
AC_VS: J2.39 ; port AC_VS
ADC_COMM: J2.11 J3.12
CAN_RX: J2.80 J3.9
CAN_TX: J2.82 J3.10
CS_BOOST1: J2.23 ; port CS_BOOST1
CS_BOOST2: J2.17 ; port CS_BOOST2
CS_BOOST3: J2.12 ; port CS_BOOST3
CS_BOOST4: J2.18 ; port CS_BOOST4
CS_CLLLC_PRI: J2.25 ; port CS_CLLLC_PRI
CS_CLLLC_SEC: J2.34 J2.36 ; port CS_CLLLC_SEC
DAC_COMM: J2.9 J3.11
DC_BUS_CS: J2.33 ; port DC_BUS_CS
DC_BUS_VS: J2.31 ; port DC_BUS_VS
DCAC_~{ENABLE}: J2.86 ; port DCAC_~{ENABLE}
HI_BOOST1: J2.56 ; port HI_BOOST1
HI_BOOST2: J2.55 ; port HI_BOOST2
HI_BOOST3: J2.51 ; port HI_BOOST3
HI_BOOST4: J2.52 ; port HI_BOOST4
IREF: J2.24 ; port IREF
ISO_PWR_EN: J2.95 ; port ISO_PWR_EN
LI_BOOST1: J2.54 ; port LI_BOOST1
LI_BOOST2: J2.53 ; port LI_BOOST2
LI_BOOST3: J2.49 ; port LI_BOOST3
LI_BOOST4: J2.50 ; port LI_BOOST4
LLC_HI1: J2.57 ; port LLC_HI1
LLC_HI2: J2.61 ; port LLC_HI2
LLC_LI1: J2.59 ; port LLC_LI1
LLC_LI2: J2.63 ; port LLC_LI2
LLC_SR_~{FAULT}_H: J2.105 ; port LLC_RECTH_FAULT
LLC_SR_~{FAULT}_L: J2.109 ; port LLC_RECTL_FAULT
LLC_SR_H: J2.58 ; port LLC_RECTH_PWM
LLC_SR_L: J2.60 ; port LLC_RECTL_PWM
LLC_SR_~{OC}_H: J2.103 ; port LLC_RECTH_OC
LLC_SR_~{OC}_L: J2.107 ; port LLC_RECTL_OC
LLC_SR_TMP_H: J2.99 ; port LLC_RECTH_TEMP
LLC_SR_TMP_L: J2.101 ; port LLC_RECTL_TEMP
LLC_VS: J2.26 ; port LLC_VS
PFC_FAULT: J2.102 ; port PFC_FAULT
PFC_H_PWM: J2.62 ; port PFC_H_PWM
PFC_H_TEMP: J2.96 ; port PFC_L_TEMP
PFC_L_PWM: J2.64 ; port PFC_L_PWM
PFC_L_TEMP: J2.94 ; port PFC_H_TEMP
PFC_OC: J2.100 ; port PFC_OC
PFC_RECT_H_PWM: J2.104 ; port PFC_RECT_H_PWM
PFC_RECT_L_PWM: J2.106 ; port PFC_RECT_L_PWM
RELAY_MCU: J2.92 ; port RELAY_MCU
SPI_CLK: J2.71 J3.5
SPI_COMM_CS: J2.73 J3.6
SPI_MISO: J2.69 J3.4
SPI_MOSI: J2.67 J3.3
Temp: J2.28 ; port Temp
UART_RX: J2.76 J3.7
UART_TX: J2.78 J3.8
VS_BOOST1: J2.21 ; port VS_BOOST1
VS_BOOST2: J2.15 ; port VS_BOOST2
VS_BOOST3: J2.14 ; port VS_BOOST3
VS_BOOST4: J2.20 ; port VS_BOOST4
NetJ2_45: J2.45 R185.2
NetJ2_119: J2.119 R65.2

Not connected (* = marked no-connect by the designer): J2 1 2 3 4 5 6 8 27 30 32 40 41 42 43 44 66 68 70 72 74 75 77 79 81 85 87 88 89 90 91 93 108 110 113 114 115 116 117 118 120

### Notes on the sheet
- Drawn By:
- SVN Rev:
- Number:
- TID #:
- Orderable:
- Rev:
- Sheet Title:
- File:
- Project Title:
- Designed for:
- Assembly Variant:
- Mod. Date:
- Sheet:
- Size:
- of
- B
- http://www.ti.com
- Texas Instruments and/or its licensors do not warrant the accuracy or completeness of this specification or any information contained therein. Texas Instruments and/or its licensors do not warrant that this design will meet the specifications, will be suitable for your application or fit for any particular purpose, or will operate in an implementation. Texas Instruments and/or its licensors do not warrant that the design is production worthy. You should completely validate and test your design implementation to confirm the system functionality for your application.
- Engineer:
- Contact:
- © Texas Instruments

### Library data of the parts
J2 = CMP-0003814-2: C2000 controlCARD-120HSEC connector, SMT; Manufacturer: Samtec; Note: The pin numbering does not match Samtec datasheet; ComponentLink1URL: http://www.samtec.com/ftppub/pdf/hsec8_dv.pdf; CompType: Connector; PackageReference: C2000 pin numbering; RoHS: Y; MountType: SMT; PartNumber: HSEC8-160-01-L-DV-A-BL; ComponentLink1Description: Datasheet Link
J3 = CMP-0055315-2: Header, 100mil, 6x2, SMT; Manufacturer: Molex; Green_Lifecycle: Active; Green_REACh: Passed; ComponentLink1URL: http://www.molex.com/pdm_docs/sd/015912120_sd.pdf; ClassName: Header; RoHS: Y; MountType: SMT; Green_EU RoHS-2: Passed; Supplier 1: Digi-Key; Green_EU RoHS: Passed; PackageReference: Header, 6x2, SMT; CompType: Header; PartNumber: 15912120; ComponentLink1Description: Datasheet URL; Supplier Part Number 1: WM17452-ND
R65 R185 = CMP-0093147-1: Res Jumper Thick Film 0402 0 Ohm 5% 1/16W Molded SMD Paper T/R; Manufacturer: Yageo; AEC Qualified: No; Power_W: 63mW; SizeZ_mm: 0.4mm; VDC_V: 50V; ComponentLink1URL: https://www.yageo.com/upload/media/product/productsearch/datasheet/rchip/PYu-RC_51_RoHS_P_2.pdf; RoHS: TRUE; Mouser Part Number: 603-RC0402JR-070RP; helpURL: https://upverter.com/upn/revision/1e1ee5977c47aafb/; Supplier Part Number 2: 603-RC0402JR-070RP; Res_ohm: 0; Supplier Part Number 1: YAG1279CT-ND; Technology: Thick Film; Datasheet Path: datasheets/Res-RC0402JR-070RP.pdf; Lead Free: Yes; Part Number: RC0402JR-070RP; ComponentLink1Description: Datasheet; Supplier 1: Digikey; PartNumber: RC0402JR-070RP; Mouser Description: RC Series 0402 Jumper Thick Film Chip Resistor; Operating Temperature Range: -55°C to +155°C; datasheet: https://www.yageo.com/upload/media/product/productsearch/datasheet/rchip/PYu-RC_51_RoHS_P_2.pdf; PackageReference: 0402; Digikey Part Number: YAG1279CT-ND; Digikey Description: RES SMD 0 OHM JUMPER 1/16W 0402; Series: RC_P; Supplier 2: Mouser

## Sheet TIDA-010933-DCDC-OpAmp.SchDoc
size 431 x 279 mm; Date: Not shown in title block; ApprovedBy: Not shown in title block; CheckedBy: Not shown in title block; Author: Not shown in title block; CompanyName: Not shown in title block; Engineer: Not shown in title block; Organization: Not shown in title block; Address1: Not shown in title block; Address2: Not shown in title block; Address3: Not shown in title block; Address4: Not shown in title block; DocumentNumber: 2; Revision: Use project parameter SCH_Rev; SheetNumber: 5; SheetTotal: 11; PageSetup: Record=PageOptions|CenterHorizontal=True|CenterVertical=True|PrintScale=1.00|XCorrection=1.00|YCorrection=1.00|PrintKind=0|BorderSize=5000000|LeftOffset=0|BottomOffset=0|Orientation=2|PaperLength=1000|PaperWidth=1000|Scale=100|PaperSource=15|PrintQuality=600|MediaType=1|DitherType=10|PaperKind=Letter|PrintScaleMode=1; CurrentTime: Not shown in title block; CurrentDate: Not shown in title block; Time: Not shown in title block; DocumentFullPathAndName: Not shown in title block; DocumentName: Not shown in title block; ModifiedDate: 1/25/2022; ImagePath: Not shown in title block
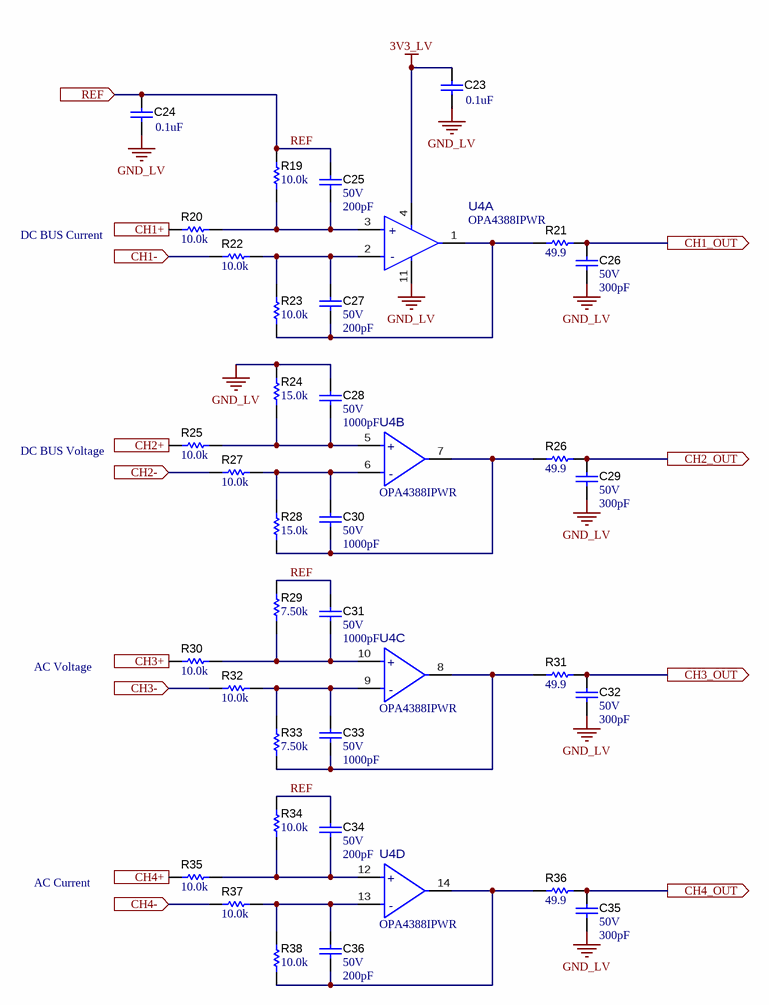
[diagram p7: TIDA-010933-DCDC-OpAmp.SchDoc]

### Parts
C23  ValueDisplayed: 0.1uF  [0402]  (hidden comment: GRM155R71E104KE14D)
C24  ValueDisplayed: 0.1uF  [0402]  (hidden comment: GRM155R71E104KE14D)
C25  VDC_V: 50V  ValueDisplayed: 200pF  [0402]  (hidden comment: GRM1555C1H201JA01D)
C26  VDC_V: 50V  ValueDisplayed: 300pF  [0402]  (hidden comment: GRM1555C1H301JA01D)
C27  VDC_V: 50V  ValueDisplayed: 200pF  [0402]  (hidden comment: GRM1555C1H201JA01D)
C28  VDC_V: 50V  ValueDisplayed: 1000pF  [0402]  (hidden comment: GRM1555C1H102FA01D)
C29  VDC_V: 50V  ValueDisplayed: 300pF  [0402]  (hidden comment: GRM1555C1H301JA01D)
C30  VDC_V: 50V  ValueDisplayed: 1000pF  [0402]  (hidden comment: GRM1555C1H102FA01D)
C31  VDC_V: 50V  ValueDisplayed: 1000pF  [0402]  (hidden comment: GRM1555C1H102FA01D)
C32  VDC_V: 50V  ValueDisplayed: 300pF  [0402]  (hidden comment: GRM1555C1H301JA01D)
C33  VDC_V: 50V  ValueDisplayed: 1000pF  [0402]  (hidden comment: GRM1555C1H102FA01D)
C34  VDC_V: 50V  ValueDisplayed: 200pF  [0402]  (hidden comment: GRM1555C1H201JA01D)
C35  VDC_V: 50V  ValueDisplayed: 300pF  [0402]  (hidden comment: GRM1555C1H301JA01D)
C36  VDC_V: 50V  ValueDisplayed: 200pF  [0402]  (hidden comment: GRM1555C1H201JA01D)
R19  ValueDisplayed: 10.0k  [0402]  (hidden comment: RT0402BRD0710KL)
R20  ValueDisplayed: 10.0k  [0402]  (hidden comment: RT0402BRD0710KL)
R21  ValueDisplayed: 49.9  [0402]  (hidden comment: RC0402FR-0749R9L)
R22  ValueDisplayed: 10.0k  [0402]  (hidden comment: RT0402BRD0710KL)
R23  ValueDisplayed: 10.0k  [0402]  (hidden comment: RT0402BRD0710KL)
R24  ValueDisplayed: 15.0k  [0402]  (hidden comment: ERA-2AEB153X)
R25  ValueDisplayed: 10.0k  [0402]  (hidden comment: RT0402BRD0710KL)
R26  ValueDisplayed: 49.9  [0402]  (hidden comment: RC0402FR-0749R9L)
R27  ValueDisplayed: 10.0k  [0402]  (hidden comment: RT0402BRD0710KL)
R28  ValueDisplayed: 15.0k  [0402]  (hidden comment: ERA-2AEB153X)
R29  ValueDisplayed: 7.50k  [0402]  (hidden comment: ERA-2AEB752X)
R30  ValueDisplayed: 10.0k  [0402]  (hidden comment: RT0402BRD0710KL)
R31  ValueDisplayed: 49.9  [0402]  (hidden comment: RC0402FR-0749R9L)
R32  ValueDisplayed: 10.0k  [0402]  (hidden comment: RT0402BRD0710KL)
R33  ValueDisplayed: 7.50k  [0402]  (hidden comment: ERA-2AEB752X)
R34  ValueDisplayed: 10.0k  [0402]  (hidden comment: RT0402BRD0710KL)
R35  ValueDisplayed: 10.0k  [0402]  (hidden comment: RT0402BRD0710KL)
R36  ValueDisplayed: 49.9  [0402]  (hidden comment: RC0402FR-0749R9L)
R37  ValueDisplayed: 10.0k  [0402]  (hidden comment: RT0402BRD0710KL)
R38  ValueDisplayed: 10.0k  [0402]  (hidden comment: RT0402BRD0710KL)
U4  OPA4388IPWR  [PW0014A-MFG]  (parts A,B,C,D of 4)

### Ports
CH1+ (in), CH1- (in), CH1_OUT (out), CH2+ (in), CH2- (in), CH2_OUT (out), CH3+ (in), CH3- (in), CH3_OUT (out), CH4+ (in), CH4- (in), CH4_OUT (out), REF (in)

### Nets
3V3_LV: C23.1 U4.4(V+)  [project net 3V3]
GND_LV: C23.2 C24.2 C26.2 C28.1 C29.2 C32.2 C35.2 R24.2 U4.11(V-)  [project net GND]
AC_CS: C35.1 R36.2 ; port CH4_OUT
AC_CS+: R35.2 ; port CH4+
AC_CS-: R37.1 ; port CH4-
AC_VS: C32.1 R31.2 ; port CH3_OUT
AC_VS+: R30.2 ; port CH3+
AC_VS-: R32.2 ; port CH3-
DC_BUS_CS: C26.1 R21.2 ; port CH1_OUT
DC_BUS_CS+: R20.1 ; port CH1+
DC_BUS_CS-: R22.1 ; port CH1-
DC_BUS_VS: C29.1 R26.2 ; port CH2_OUT
DC_BUS_VS+: R25.2 ; port CH2+
DC_BUS_VS-: R27.2 ; port CH2-
REF: C24.1 C25.2 C31.1 C34.2 R19.2 R29.2 R34.1 ; port REF  [project net IREF]
NetC25_1: C25.1 R19.1 R20.2 U4.3(+IN_A)
NetC27_1: C27.1 R21.1 R23.1 U4.1(OUT_A)
NetC27_2: C27.2 R22.2 R23.2 U4.2(-IN_A)
NetC28_2: C28.2 R24.1 R25.1 U4.5(+IN_B)
NetC30_1: C30.1 R27.1 R28.2 U4.6(-IN_B)
NetC30_2: C30.2 R26.1 R28.1 U4.7(OUT_B)
NetC31_2: C31.2 R29.1 R30.1 U4.10(+IN_C)
NetC33_1: C33.1 R32.1 R33.2 U4.9(-IN_C)
NetC33_2: C33.2 R31.1 R33.1 U4.8(OUT_C)
NetC34_1: C34.1 R34.2 R35.1 U4.12(+IN_D)
NetC36_1: C36.1 R36.1 R38.2 U4.14(OUT_D)
NetC36_2: C36.2 R37.2 R38.1 U4.13(-IN_D)

### Notes on the sheet
- DC BUS Current
- DC BUS Voltage
- AC Voltage
- AC Current
- Drawn By:
- SVN Rev:
- Number:
- TID #:
- Orderable:
- Rev:
- Sheet Title:
- File:
- Project Title:
- Designed for:
- Assembly Variant:
- Mod. Date:
- Sheet:
- Size:
- of
- B
- http://www.ti.com
- Texas Instruments and/or its licensors do not warrant the accuracy or completeness of this specification or any information contained therein. Texas Instruments and/or its licensors do not warrant that this design will meet the specifications, will be suitable for your application or fit for any particular purpose, or will operate in an implementation. Texas Instruments and/or its licensors do not warrant that the design is production worthy. You should completely validate and test your design implementation to confirm the system functionality for your application.
- Engineer:
- Contact:
- © Texas Instruments
- (in symbol CMP-0121217-1, part A) +; -
- (in symbol CMP-0121217-1, part B) +; -
- (in symbol CMP-0121217-1, part C) +; -
- (in symbol CMP-0121217-1, part D) +; -

### Library data of the parts
C23 C24 = CMP-0006659-2: as C110 on sheet TIDA-010933-DCDC-Power; Supplier Part Number 2: 31Y1751; Publisher: Texas Instruments; Supplier 2: Newark; Supplier Part Number 3: 81-GRM155R71E104KE4D; TempCo: X7R; Supplier 3: Mouser; Published: 2008-06-19; RoHS: Y; MountType: SMT; Supplier 1: Digi-Key; PackageReference: 0402; Tolerance_%: 10%; Cap_Case: 0402; SizeArea_mm2: 0.5; CompType: Capacitor; LatestRevisionDate: 2017-03-09; PartNumber: GRM155R71E104KE14D; AEC Qualified: N; VDC_V: 25V; ComponentLink1Description: Datasheet link; AEC Grade: N/A; Supplier Part Number 1: 490-10698-1-ND; Technology: Ceramic; ComponentLink1URL: http://search.murata.co.jp/Ceramy/image/img/A01X/G101/ENG/GRM155R71E104KE14-01.pdf
C25 C27 C34 C36 = CMP-0006437-2: CAP, CERM, 200 pF, 50 V, +/- 5%, C0G/NP0, 0402; Manufacturer: MuRata; TaMin_C: -55°C; Polarized: N; SizeAreaWB_mm2: 3; Value1: Unknown; U/M: EA; Value: 200pF; TaMax_C: 125°C; SizeZ_mm: 0.6; SizeX_mm: 1; SizeY_mm: 0.5; AEC Category: Q200; Supplier Part Number 2: 81-GRM1555C1H201JA1D; Publisher: Texas Instruments; Supplier 2: Mouser; TempCo: C0G/NP0; Published: 2008-06-19; RoHS: Y; MountType: SMT; Supplier 1: Digi-Key; PackageReference: 0402; Tolerance_%: 5%; Cap_Case: 0402; Value2: 50V; SizeArea_mm2: 0.5; CompType: Capacitor; LatestRevisionDate: 2017-03-09; PartNumber: GRM1555C1H201JA01D; AEC Qualified: ?; Cap_F: 200pF; ComponentLink1Description: Datasheet link; Supplier Part Number 1: 490-3232-1-ND; Technology: Ceramic; ComponentLink1URL: http://search.murata.co.jp/Ceramy/PnsearchViewAction.do?HnOFG=ON&HnNFG=ON&SEL_CNT=50&sLang=en&sKey=GRM1555C1H201JA01D&x=9&y=9&search=startwith
C26 C29 C32 C35 = CMP-0006453-2: CAP, CERM, 300 pF, 50 V, +/- 5%, C0G/NP0, 0402; Manufacturer: MuRata; TaMin_C: -55°C; Polarized: N; SizeAreaWB_mm2: 3; Value1: Unknown; U/M: EA; Value: 300pF; TaMax_C: 125°C; SizeZ_mm: 0.6; SizeX_mm: 1; SizeY_mm: 0.5; AEC Category: Q200; Supplier Part Number 2: 81-GRM1555C1H301JA1D; Publisher: Texas Instruments; Supplier 2: Mouser; TempCo: C0G/NP0; Published: 2008-06-19; RoHS: Y; MountType: SMT; Supplier 1: Digi-Key; PackageReference: 0402; Tolerance_%: 5%; Cap_Case: 0402; Value2: 50V; SizeArea_mm2: 0.5; CompType: Capacitor; LatestRevisionDate: 2017-03-09; PartNumber: GRM1555C1H301JA01D; AEC Qualified: ?; Cap_F: 300pF; ComponentLink1Description: Datasheet link; Supplier Part Number 1: 490-3234-1-ND; Technology: Ceramic; ComponentLink1URL: http://search.murata.co.jp/Ceramy/PnsearchViewAction.do?HnOFG=ON&HnNFG=ON&SEL_CNT=50&sLang=en&sKey=GRM1555C1H301JA01D&x=9&y=9&search=startwith
C28 C30 C31 C33 = CMP-0006411-2: CAP, CERM, 1000 pF, 50 V, +/- 1%, C0G/NP0, 0402; Manufacturer: MuRata; TaMin_C: -55°C; Polarized: N; SizeAreaWB_mm2: 3; Value1: Unknown; U/M: EA; Value: 1000pF; TaMax_C: 125°C; SizeZ_mm: 0.6; SizeX_mm: 1; SizeY_mm: 0.5; Cap_F: 1nF; AEC Category: Q200; Supplier Part Number 2: 45Y5213; Publisher: Texas Instruments; Supplier 2: Newark; Supplier Part Number 3: 81-GRM1555C1H102FA1D; TempCo: C0G/NP0; Supplier 3: Mouser; Published: 2008-06-19; RoHS: Y; MountType: SMT; Supplier 1: Digi-Key; PackageReference: 0402; Tolerance_%: 1%; Cap_Case: 0402; Value2: 50V; SizeArea_mm2: 0.5; CompType: Capacitor; LatestRevisionDate: 2017-03-09; PartNumber: GRM1555C1H102FA01D; AEC Qualified: N; ComponentLink1Description: Datasheet link; AEC Grade: N/A; Supplier Part Number 1: 490-6189-1-ND; Technology: Ceramic; ComponentLink1URL: http://search.murata.co.jp/Ceramy/image/img/A01X/G101/ENG/GRM1555C1H102FA01-01.pdf
R19 R20 R22 R23 R25 R27 R30 R32 R34 R35 R37 R38 = CMP-0065360-1: RES, 10.0 k, .1%, .0625 W, 0402; Manufacturer: Yageo America; Power_W: 62.5mW; TempCo: 25 ppm/C; Value_Code: 10k0; U/M: EA; Value: 10.0k; EIA_Code: E192; Tolerance_%: 0.1%; Res_ohm: 10k; SizeX_mm: 1.0; SizeY_mm: 0.5; SizeZ_mm: 0.6; Value2: .0625W; VDC_V: 50V; AEC Category: Q200; ComponentLink1URL: http://www.yageo.com/NewPortal/yageodocoutput?fileName=/pdf/R-Chip/PYu-RT_1-to-0.01_RoHS_L_8.pdf; Supplier Part Number 2: 66R6774; Publisher: Texas Instruments; Supplier 2: Newark; Supplier Part Number 3: 603-RT0402BRD0710KL; Supplier 3: Mouser; Published: 2008-06-26; RoHS: Y; Value1: .1%; MountType: SMT; Supplier 1: Digi-Key; PackageReference: 0402; SizeArea_mm2: 0.5; CompType: Resistor; LatestRevisionDate: 2017-06-05; PartNumber: RT0402BRD0710KL; AEC Qualified: ?; ComponentLink1Description: Datasheet link; Supplier Part Number 1: YAG1346CT-ND; Technology: Thin Film
R21 R26 R31 R36 = CMP-0026738-1: RES, 49.9, 1%, 0.063 W, 0402; Manufacturer: Yageo America; Power_W: 63mW; TempCo: 100 ppm/C; Value_Code: 49R9; U/M: EA; Value: 49.9; EIA_Code: E96; SizeX_mm: 1; SizeY_mm: 0.5; SizeZ_mm: 0.6; Value2: 0.063W; AEC Qualified: N; VDC_V: 50V; AEC Category: Q200; ComponentLink1URL: http://www.yageo.com/documents/recent/PYu-RC_Group_51_RoHS_L_1.pdf; Supplier Part Number 2: 67R9942; Publisher: Texas Instruments; Supplier 2: Newark; Supplier Part Number 3: 603-RC0402FR-0749R9L; Supplier 3: Mouser; Published: 2008-06-26; RoHS: Y; Value1: 1%; MountType: SMT; Supplier 1: Digi-Key; PackageReference: 0402; Tolerance_%: 1%; Res_ohm: 49.9; SizeArea_mm2: 0.5; CompType: Resistor; LatestRevisionDate: 2017-03-09; PartNumber: RC0402FR-0749R9L; ComponentLink1Description: Datasheet link; AEC Grade: N/A; Supplier Part Number 1: 311-49.9LRCT-ND; Technology: Thick Film
R24 R28 = CMP-0065359-1: RES, 15.0 k, .1%, .063 W, AEC-Q200 Grade 0, 0402; Manufacturer: Panasonic; Power_W: 63mW; TempCo: 25 ppm/C; Value_Code: 15k0; U/M: EA; Value: 15.0k; EIA_Code: E192; Tolerance_%: 0.1%; Res_ohm: 15k; SizeX_mm: 1.0; SizeY_mm: 0.5; SizeZ_mm: 0.6; Value2: .063W; AEC Qualified: Y; VDC_V: 50V; AEC Grade: 0; AEC Category: Q200; ComponentLink1URL: https://industrial.panasonic.com/cdbs/www-data/pdf/RDM0000/AOA0000C237.pdf; Supplier Part Number 2: 53W8333; Publisher: Texas Instruments; Supplier 2: Newark; Supplier Part Number 3: 667-ERA-2AEB153X; Supplier 3: Mouser; Published: 2008-06-26; RoHS: Y; Value1: .1%; MountType: SMT; Supplier 1: Digi-Key; PackageReference: 0402; SizeArea_mm2: 0.5; CompType: Resistor; LatestRevisionDate: 2017-06-05; PartNumber: ERA-2AEB153X; ComponentLink1Description: Datasheet link; Supplier Part Number 1: P15KDCCT-ND; Technology: Thin Film
R29 R33 = CMP-0026786-1: RES, 7.50 k, 0.1%, 0.063 W, AEC-Q200 Grade 0, 0402; Manufacturer: Panasonic; Power_W: 63mW; TempCo: 25 ppm/C; Value_Code: 7k50; U/M: EA; Value: 7.50k; EIA_Code: E192; Res_ohm: 7.5k; SizeX_mm: 1; SizeY_mm: 0.5; SizeZ_mm: 0.6; Value2: 0.063W; AEC Qualified: Y; VDC_V: 50V; AEC Grade: 0; AEC Category: Q200; ComponentLink1URL: http://industrial.panasonic.com/lecs/www-data/pdf/AOA0000/AOA0000CE26.pdf; Supplier Part Number 2: 49W8962; Publisher: Texas Instruments; Supplier 2: Newark; Supplier Part Number 3: 667-ERA-2AEB752X; Supplier 3: Mouser; Published: 2008-06-26; RoHS: Y; Value1: 0.1%; MountType: SMT; Supplier 1: Digi-Key; PackageReference: 0402; Tolerance_%: 0.1%; SizeArea_mm2: 0.5; CompType: Resistor; LatestRevisionDate: 2017-03-09; PartNumber: ERA-2AEB752X; ComponentLink1Description: Datasheet link; Supplier Part Number 1: P7.5KDCCT-ND; Technology: Thin Film
U4 = CMP-0121217-1: Zero-Drift Amplifier 4 Circuit Rail-to-Rail 14-TSSOP; Manufacturer: Texas Instruments; SizeZ_mm: 1.2mm; AEC Qualified: No; Gain Bandwidth: 10MHz; Input Bias Current: 0.00003uA; Input Offset Voltage: 0.00225mV; Max Dual Supply Voltage: 2.75V; Max Supply Voltage: 5.5V; Min Dual Supply Voltage: 1.25V; Min Supply Voltage: 2.5V; Nominal Supply Current: 1.7-1.9mA; Number Of Channels: 4; Output Current Per Channel: 60mA; Response Time: 0.75us; Standoff Height: 0.05mm; TaMax_C: +150°C; TaMin_C: -55°C; Voltage Gain: 126dB; PackageReference: TSSOP14; PartNumber: OPA4388IPWR; RoHS: TRUE; Operating Temperature Range: -40°C to +125°C; Part Number: OPA4388IPWR; datasheet: https://www.ti.com/lit/ds/symlink/opa4388.pdf?ts=1615809516959&ref_url=https%253A%252F%252Fwww.ti.com%252Fproduct%252FOPA4388%253FkeyMatch%253DOPA4388IPWR%2526tisearch%253DSearch-EN-everything%2526usecase%253DOPN; Datasheet Path: datasheets/IC-OPA4388IPWR.pdf; Digikey Description: IC OPAMP ZER-DRIFT 4CIRC 14TSSOP; Digikey Part Number: 296-OPA4388IPWRCT-ND; helpURL: https://upverter.com/upn/revision/38c17684e2773244/; Lead Free: Yes; Mouser Description: Op Amp Quad Zero Drift Amplifier R-R I/O ±2.75V/5.5V 14-Pin TSSOP T/R; Mouser Part Number: 595-OPA4388IPWR; TJmax_C: +150°C; ComponentLink1Description: Datasheet; ComponentLink1URL: https://www.ti.com/lit/ds/symlink/opa4388.pdf?ts=1615809516959&ref_url=https%253A%252F%252Fwww.ti.com%252Fproduct%252FOPA4388%253FkeyMatch%253DOPA4388IPWR%2526tisearch%253DSearch-EN-everything%2526usecase%253DOPN